# Altium schematic sheet 2S_BATTERY_CHARGER_SCH.SchDoc
size 300 x 200 mm
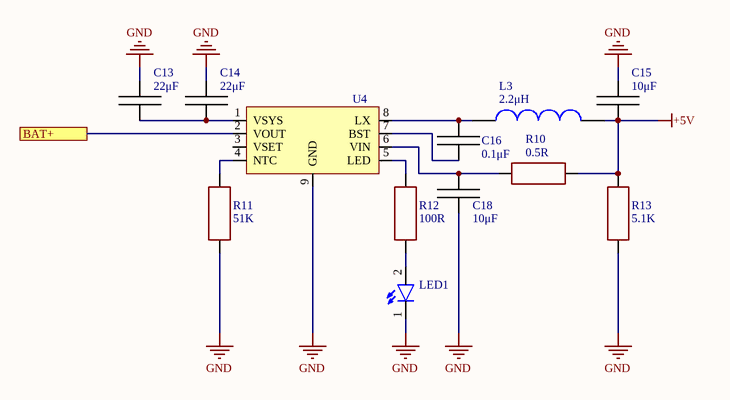
[diagram p0: 2S_BATTERY_CHARGER_SCH.SchDoc]

## Parts
C13  value 22μF  [CAP: 0603]  (hidden comment: Cap_0603)
C14  value 22μF  [CAP: 0603]  (hidden comment: Cap_0603)
C15  value 10μF  [CAP: 0603]  (hidden comment: Cap_0603)
C16  value 0.1μF  [CAP: 0603]  (hidden comment: Cap_0603)
C18  value 10μF  [CAP: 0603]  (hidden comment: Cap_0603)
L3  value 2.2μH  [CD43]  (hidden comment: CD43)
LED1  LED_0603  [LED_0603]  (value not drawn)
R10  value 0.5R  [RES: 0603]  (hidden comment: Resistor_0603)
R11  value 51K  [RES: 0603]  (hidden comment: Resistor_0603)
R12  value 100R  [RES: 0603]  (hidden comment: Resistor_0603)
R13  value 5.1K  [RES: 0603]  (hidden comment: Resistor_0603)
U4  IP2325  [ESOP-8]  (value not drawn)

## Ports
BAT+

## Nets
+5V: C15.2 L3.1 R10.1 R13.2
GND: C13.1 C14.1 C15.1 C18.1 LED1.1 R11.1 R13.1 U4.9(GND)
BAT+: U4.2(VOUT) ; port BAT+
NetC13_2: C13.2 C14.2 U4.1(VSYS)
NetC16_1: C16.1 U4.7(BST)
NetC16_2: C16.2 L3.2 U4.8(LX)
NetC18_2: C18.2 R10.2 U4.6(VIN)
NetLED1_2: LED1.2 R12.1
NetR11_2: R11.2 U4.4(NTC)
NetR12_2: R12.2 U4.5(LED)

Not connected (* = marked no-connect by the designer): U4 3(VSET)

## Library data of the parts
C13-C16 C18 = Cap_0603: TypeDielectric: X7R(X5R); Voltage: ??V; Package/Case: 0603; Temperature: -55...+125°C(-55...+85°C); Product Category: Capacitors
L3 = CD43: SMD Power Inductor; Manufacturer: SUMIDA; Datasheet: https://products.sumida.com/products/pdf/CD43.pdf; HelpURL: https://aliexpress.ru/item/1005002090028747.html?sku_id=12000018707218161&spm=a2g2w.productlist.search_results.13.550c3fc1XziZsU; Product Category: Inductors
R10-R13 = Resistor_0603: Tolerance: ±5%; Package/Case: 0603; Temperature: -55...+125°C; Product Category: Resistors
U4 = IP2325: 2s charge Module; Manufacturer: INJOINIC; Datasheet: http://www.injoinic.com/wwwroot/uploads/files/20230913/d8e5944686d69fa501fe83e437133f8d.pdf; HelpURL: https://aliexpress.ru/item/1005005892683023.html?sku_id=12000034732384666; Package/Case: ESOP-8; Product Category: Charge modules; Value: IP2325
LED1 = LED_0603: Product Category: LED; Value: LED_0603